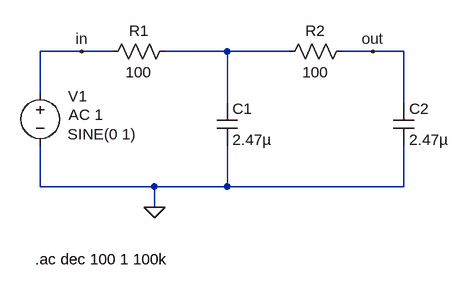
[diagram p0: schematic 01 Passiver Tiefpass-Filter.asc]
01 Passiver Tiefpass-Filter.asc, the LTspice schematic file:
Version 4
SHEET 1 880 680
WIRE -48 64 -112 64
WIRE 0 64 -48 64
WIRE 176 64 80 64
WIRE 272 64 176 64
WIRE 400 64 352 64
WIRE 448 64 400 64
WIRE -112 128 -112 64
WIRE 176 144 176 64
WIRE 448 144 448 64
WIRE -112 272 -112 208
WIRE 64 272 -112 272
WIRE 176 272 176 208
WIRE 176 272 64 272
WIRE 448 272 448 208
WIRE 448 272 176 272
WIRE 64 304 64 272
FLAG 64 304 0
FLAG -48 64 in
FLAG 400 64 out
SYMBOL cap 160 144 R0
SYMATTR InstName C1
SYMATTR Value 2.47µ
SYMBOL res 96 48 R90
WINDOW 0 0 56 VBottom 2
WINDOW 3 32 56 VTop 2
SYMATTR InstName R1
SYMATTR Value 100
SYMBOL voltage -112 112 R0
WINDOW 3 42 79 Left 2
WINDOW 123 44 49 Left 2
WINDOW 39 0 0 Left 0
WINDOW 0 43 21 Left 2
SYMATTR Value SINE(0 1)
SYMATTR Value2 AC 1
SYMATTR InstName V1
SYMBOL res 368 48 R90
WINDOW 0 0 56 VBottom 2
WINDOW 3 32 56 VTop 2
SYMATTR InstName R2
SYMATTR Value 100
SYMBOL cap 432 144 R0
SYMATTR InstName C2
SYMATTR Value 2.47µ
TEXT -120 384 Left 2 !.ac dec 100 1 100k

The netlist it stands for:
* 01 Passiver Tiefpass-Filter.asc
C1 N001 0 2.47µ
R1 N001 in 100
V1 in 0 SINE(0 1) AC 1
R2 out N001 100
C2 out 0 2.47µ
.ac dec 100 1 100k
.backanno
.end